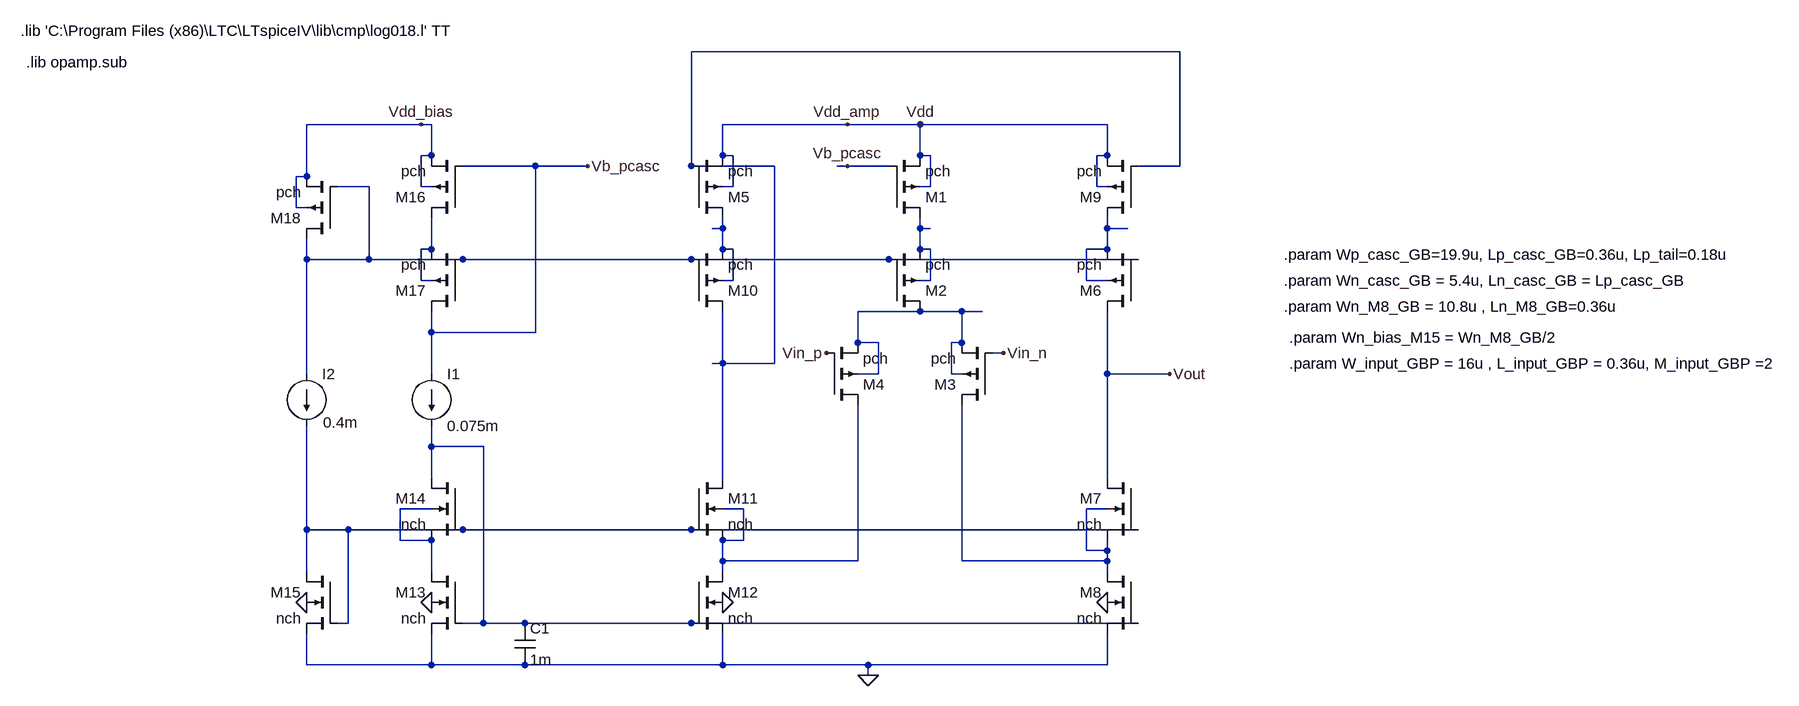
[diagram p0: schematic GB-PMOS.asc]
GB-PMOS.asc, the LTspice schematic file:
Version 4
SHEET 1 3836 784
WIRE 1584 -992 832 -992
WIRE 416 -880 240 -880
WIRE 432 -880 416 -880
WIRE 1072 -880 880 -880
WIRE 1184 -880 1072 -880
WIRE 1376 -880 1184 -880
WIRE 1472 -880 1376 -880
WIRE 432 -832 432 -880
WIRE 432 -832 416 -832
WIRE 880 -832 880 -880
WIRE 896 -832 880 -832
WIRE 1184 -832 1184 -880
WIRE 1200 -832 1184 -832
WIRE 1472 -832 1472 -880
WIRE 1472 -832 1456 -832
WIRE 560 -816 480 -816
WIRE 592 -816 560 -816
WIRE 672 -816 592 -816
WIRE 832 -816 832 -992
WIRE 960 -816 832 -816
WIRE 1072 -816 1056 -816
WIRE 1136 -816 1072 -816
WIRE 1584 -816 1584 -992
WIRE 1584 -816 1520 -816
WIRE 240 -800 240 -880
WIRE 240 -800 224 -800
WIRE 336 -784 288 -784
WIRE 416 -784 416 -832
WIRE 432 -784 416 -784
WIRE 896 -784 896 -832
WIRE 896 -784 880 -784
WIRE 1200 -784 1200 -832
WIRE 1200 -784 1184 -784
WIRE 1456 -784 1456 -832
WIRE 1472 -784 1456 -784
WIRE 224 -752 224 -800
WIRE 240 -752 224 -752
WIRE 880 -720 880 -736
WIRE 880 -720 864 -720
WIRE 1184 -720 1184 -736
WIRE 1200 -720 1184 -720
WIRE 1472 -720 1472 -736
WIRE 1504 -720 1472 -720
WIRE 432 -688 432 -736
WIRE 432 -688 416 -688
WIRE 880 -688 880 -720
WIRE 896 -688 880 -688
WIRE 1184 -688 1184 -720
WIRE 1200 -688 1184 -688
WIRE 1472 -688 1472 -720
WIRE 1472 -688 1440 -688
WIRE 240 -672 240 -704
WIRE 336 -672 336 -784
WIRE 336 -672 240 -672
WIRE 480 -672 336 -672
WIRE 688 -672 480 -672
WIRE 832 -672 688 -672
WIRE 1136 -672 832 -672
WIRE 1520 -672 1136 -672
WIRE 416 -640 416 -688
WIRE 432 -640 416 -640
WIRE 896 -640 896 -688
WIRE 896 -640 880 -640
WIRE 1200 -640 1200 -688
WIRE 1200 -640 1184 -640
WIRE 1440 -640 1440 -688
WIRE 1472 -640 1440 -640
WIRE 1184 -592 1088 -592
WIRE 1248 -592 1184 -592
WIRE 1280 -592 1248 -592
WIRE 432 -560 432 -592
WIRE 592 -560 592 -816
WIRE 592 -560 432 -560
WIRE 1088 -544 1088 -592
WIRE 1120 -544 1088 -544
WIRE 1248 -544 1248 -592
WIRE 1248 -544 1232 -544
WIRE 1312 -528 1296 -528
WIRE 880 -512 880 -592
WIRE 880 -512 864 -512
WIRE 960 -512 960 -816
WIRE 960 -512 880 -512
WIRE 240 -496 240 -672
WIRE 432 -496 432 -560
WIRE 1120 -496 1120 -544
WIRE 1120 -496 1088 -496
WIRE 1232 -496 1232 -544
WIRE 1248 -496 1232 -496
WIRE 1472 -496 1472 -592
WIRE 1536 -496 1472 -496
WIRE 1568 -496 1536 -496
WIRE 880 -400 880 -512
WIRE 1088 -400 1088 -448
WIRE 1248 -400 1248 -448
WIRE 1472 -400 1472 -496
WIRE 432 -384 432 -416
WIRE 512 -384 432 -384
WIRE 432 -336 432 -384
WIRE 880 -336 880 -400
WIRE 1472 -336 1472 -400
WIRE 432 -288 384 -288
WIRE 912 -288 880 -288
WIRE 1472 -288 1440 -288
WIRE 240 -256 240 -416
WIRE 304 -256 240 -256
WIRE 480 -256 304 -256
WIRE 640 -256 480 -256
WIRE 832 -256 640 -256
WIRE 1520 -256 832 -256
WIRE 384 -240 384 -288
WIRE 432 -240 384 -240
WIRE 912 -240 912 -288
WIRE 912 -240 880 -240
WIRE 1440 -224 1440 -288
WIRE 1472 -224 1472 -240
WIRE 1472 -224 1440 -224
WIRE 880 -208 880 -240
WIRE 960 -208 880 -208
WIRE 1088 -208 1088 -400
WIRE 1088 -208 960 -208
WIRE 1248 -208 1248 -400
WIRE 1392 -208 1248 -208
WIRE 1472 -208 1472 -224
WIRE 1472 -208 1392 -208
WIRE 240 -192 240 -256
WIRE 432 -192 432 -240
WIRE 880 -192 880 -208
WIRE 1472 -192 1472 -208
WIRE 304 -112 304 -256
WIRE 304 -112 288 -112
WIRE 512 -112 512 -384
WIRE 512 -112 480 -112
WIRE 576 -112 512 -112
WIRE 672 -112 576 -112
WIRE 832 -112 672 -112
WIRE 1520 -112 832 -112
WIRE 240 -48 240 -96
WIRE 432 -48 432 -96
WIRE 432 -48 240 -48
WIRE 576 -48 432 -48
WIRE 880 -48 880 -96
WIRE 880 -48 576 -48
WIRE 1104 -48 880 -48
WIRE 1472 -48 1472 -96
WIRE 1472 -48 1104 -48
WIRE 1104 -32 1104 -48
FLAG 880 -144 0
FLAG 1072 -880 Vdd_amp
FLAG 432 -144 0
FLAG 240 -144 0
FLAG 1472 -144 0
FLAG 1104 -32 0
FLAG 1568 -496 Vout
FLAG 1040 -528 Vin_p
FLAG 1312 -528 Vin_n
FLAG 672 -816 Vb_pcasc
FLAG 1072 -816 Vb_pcasc
FLAG 416 -880 Vdd_bias
FLAG 1184 -880 Vdd
DATAFLAG 960 -208 "round($*10k)/10k"
DATAFLAG 1392 -208 "round($*10k)/10k"
DATAFLAG 1376 -880 "round($*1k)/1k"
DATAFLAG 1248 -400 "round(-Id(x6:x3:M3)*10000000)/10000000"
DATAFLAG 1200 -720 "round($*100)/100"
DATAFLAG 1504 -720 "round($*100)/100"
DATAFLAG 864 -720 "round($*100)/100"
DATAFLAG 688 -672 "round($*100)/100"
DATAFLAG 560 -816 "round($*100)/100"
DATAFLAG 640 -256 "round($*100)/100"
DATAFLAG 672 -112 "round($*100)/100"
DATAFLAG 864 -512 "round($*100)/100"
DATAFLAG 1536 -496 "round($*100)/100"
DATAFLAG 1280 -592 "round($*100)/100"
DATAFLAG 1088 -400 "round(-Id(x6:x3:M4)*10000000)/10000000"
DATAFLAG 880 -400 "round(Id(x6:x3:M11)*10000000)/10000000"
DATAFLAG 1472 -400 "round(Id(x6:x3:M7)*10000000)/10000000"
SYMBOL pmos4 832 -592 M180
SYMATTR InstName M10
SYMATTR Value pch
SYMATTR Value2 l={Lp_casc_GB} w={Wp_casc_GB}
SYMBOL nmos4 832 -336 R0
SYMATTR InstName M11
SYMATTR Value nch
SYMATTR Value2 l={Ln_casc_GB} w={Wn_casc_GB}
SYMBOL nmos4 832 -192 R0
SYMATTR InstName M12
SYMATTR Value nch
SYMATTR Value2 l={Ln_casc_GB} w={Wn_M8_GB}
SYMBOL pmos4 832 -736 M180
SYMATTR InstName M5
SYMATTR Value pch
SYMATTR Value2 l={Lp_casc_GB} w={Wp_casc_GB}
SYMBOL nmos4 480 -192 M0
SYMATTR InstName M13
SYMATTR Value nch
SYMATTR Value2 l={Ln_casc_GB} w={Wn_M8_GB}
SYMBOL current 432 -496 R0
WINDOW 123 0 0 Left 2
WINDOW 39 0 0 Left 2
SYMATTR InstName I1
SYMATTR Value 0.075m
SYMBOL nmos4 480 -336 M0
SYMATTR InstName M14
SYMATTR Value nch
SYMATTR Value2 l={Ln_casc_GB} w={Wn_casc_GB}
SYMBOL current 240 -496 R0
WINDOW 123 0 0 Left 2
WINDOW 39 0 0 Left 2
WINDOW 3 25 75 Left 2
SYMATTR Value 0.4m
SYMATTR InstName I2
SYMBOL nmos4 288 -192 M0
SYMATTR InstName M15
SYMATTR Value nch
SYMATTR Value2 l={Ln_M8_GB} w={Wn_casc_GB} m=2
SYMBOL pmos4 480 -736 R180
SYMATTR InstName M16
SYMATTR Value pch
SYMATTR Value2 l={Lp_casc_GB} w={Wp_casc_GB}
SYMBOL pmos4 480 -592 R180
SYMATTR InstName M17
SYMATTR Value pch
SYMATTR Value2 l={Lp_casc_GB} w={Wp_casc_GB}
SYMBOL pmos4 288 -704 R180
SYMATTR InstName M18
SYMATTR Value pch
SYMATTR Value2 l={Lp_casc_GB} w={Wp_casc_GB}
SYMBOL pmos4 1520 -592 R180
SYMATTR InstName M6
SYMATTR Value pch
SYMATTR Value2 l={Lp_casc_GB} w={Wp_casc_GB}
SYMBOL nmos4 1520 -336 M0
SYMATTR InstName M7
SYMATTR Value nch
SYMATTR Value2 l={Ln_casc_GB} w={Wn_casc_GB}
SYMBOL nmos4 1520 -192 M0
SYMATTR InstName M8
SYMATTR Value nch
SYMATTR Value2 l={Ln_casc_GB} w={Wn_M8_GB}
SYMBOL pmos4 1520 -736 R180
SYMATTR InstName M9
SYMATTR Value pch
SYMATTR Value2 l={Lp_casc_GB} w={Wp_casc_GB}
SYMBOL pmos4 1136 -736 M180
SYMATTR InstName M1
SYMATTR Value pch
SYMATTR Value2 l={Lp_casc_GB} w={Wp_casc_GB} m=2
SYMBOL pmos4 1136 -592 M180
SYMATTR InstName M2
SYMATTR Value pch
SYMATTR Value2 l={Lp_tail} w={Wp_casc_GB} m=2
SYMBOL pmos4 1296 -448 R180
SYMATTR InstName M3
SYMATTR Value pch
SYMATTR Value2 l={L_input_GBP} w={W_input_GBP} m={M_input_GBP}
SYMBOL pmos4 1040 -448 M180
SYMATTR InstName M4
SYMATTR Value pch
SYMATTR Value2 l={L_input_GBP} w={W_input_GBP} m={M_input_GBP}
SYMBOL cap 560 -112 R0
SYMATTR InstName C1
SYMATTR Value 1m
TEXT -200 -1024 Left 2 !.lib 'C:\\Program Files (x86)\\LTC\\LTspiceIV\\lib\\cmp\\log018.l' TT
TEXT -192 -976 Left 2 !.lib opamp.sub
TEXT 1744 -680 Left 2 !.param Wp_casc_GB=19.9u, Lp_casc_GB=0.36u, Lp_tail=0.18u
TEXT 1744 -640 Left 2 !.param Wn_casc_GB = 5.4u, Ln_casc_GB = Lp_casc_GB
TEXT 1744 -600 Left 2 !.param Wn_M8_GB = 10.8u , Ln_M8_GB=0.36u
TEXT 1752 -552 Left 2 !.param Wn_bias_M15 = Wn_M8_GB/2
TEXT 1752 -512 Left 2 !.param W_input_GBP = 16u , L_input_GBP = 0.36u, M_input_GBP =2

The netlist it stands for:
* GB-PMOS.asc
M10 N001 N002 N003 N003 pch l={Lp_casc_GB} w={Wp_casc_GB}
M11 N001 N012 N008 N008 nch l={Ln_casc_GB} w={Wn_casc_GB}
M12 N008 N010 0 0 nch l={Ln_casc_GB} w={Wn_M8_GB}
M5 N003 N001 Vdd Vdd pch l={Lp_casc_GB} w={Wp_casc_GB}
M13 N011 N010 0 0 nch l={Ln_casc_GB} w={Wn_M8_GB}
I1 Vb_pcasc N010 0.075m
M14 N010 N012 N011 N011 nch l={Ln_casc_GB} w={Wn_casc_GB}
I2 N002 N012 0.4m
M15 N012 N012 0 0 nch l={Ln_M8_GB} w={Wn_casc_GB} m=2
M16 N006 Vb_pcasc Vdd_bias Vdd_bias pch l={Lp_casc_GB} w={Wp_casc_GB}
M17 Vb_pcasc N002 N006 N006 pch l={Lp_casc_GB} w={Wp_casc_GB}
M18 N002 N002 Vdd_bias Vdd_bias pch l={Lp_casc_GB} w={Wp_casc_GB}
M6 Vout N002 N005 N005 pch l={Lp_casc_GB} w={Wp_casc_GB}
M7 Vout N012 N009 N009 nch l={Ln_casc_GB} w={Wn_casc_GB}
M8 N009 N010 0 0 nch l={Ln_casc_GB} w={Wn_M8_GB}
M9 N005 N001 Vdd Vdd pch l={Lp_casc_GB} w={Wp_casc_GB}
M1 N004 Vb_pcasc Vdd Vdd pch l={Lp_casc_GB} w={Wp_casc_GB} m=2
M2 N007 N002 N004 N004 pch l={Lp_tail} w={Wp_casc_GB} m=2
M3 N009 Vin_n N007 N007 pch l={L_input_GBP} w={W_input_GBP} m={M_input_GBP}
M4 N008 Vin_p N007 N007 pch l={L_input_GBP} w={W_input_GBP} m={M_input_GBP}
C1 N010 0 1m
.model NMOS NMOS
.model PMOS PMOS
.lib standard.mos
.lib 'C:\Program Files (x86)\LTC\LTspiceIV\lib\cmp\log018.l' TT
.lib opamp.sub
.param Wp_casc_GB=19.9u, Lp_casc_GB=0.36u, Lp_tail=0.18u
.param Wn_casc_GB = 5.4u, Ln_casc_GB = Lp_casc_GB
.param Wn_M8_GB = 10.8u , Ln_M8_GB=0.36u
.param Wn_bias_M15 = Wn_M8_GB/2
.param W_input_GBP = 16u , L_input_GBP = 0.36u, M_input_GBP =2
.backanno
.end